# EAGLE design OneWireGateway_2x_0.2 (EAGLE 7.2.0)
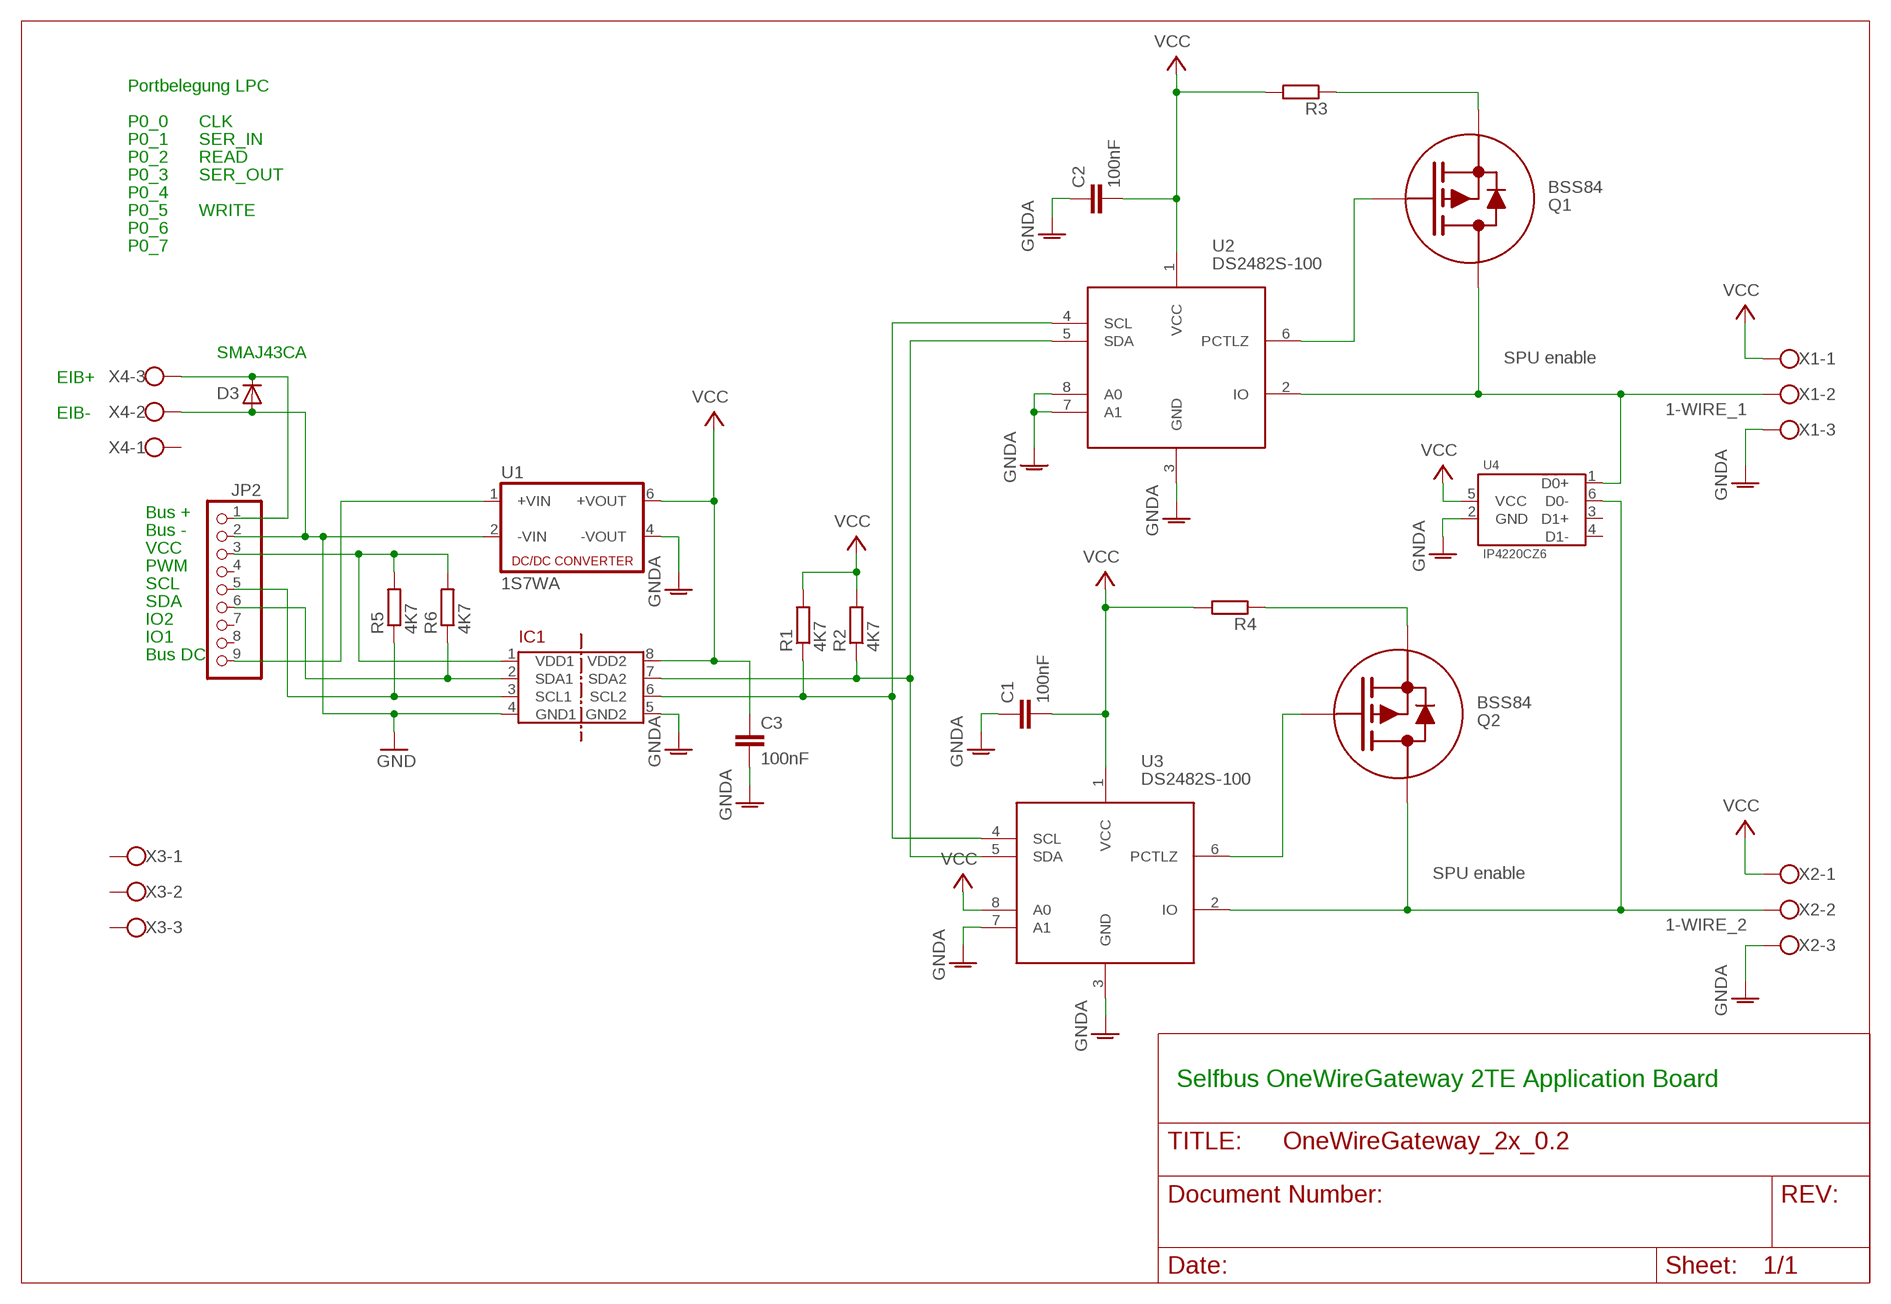
[diagram p0: schematic, sheet 1]

## Parts
C1  100nF  C-EUC0805  [C0805]
C2  100nF  C-EUC0805  [C0805]
C3  100nF  C-EUC0805  [C0805]
D3  D-SMB  [SMB]
IC1  ADUM1250  [SO08]
JP2  PINHD-1X9  [1X09]
Q1  BSS84  BSS841  [SOT-23-3]
Q2  BSS84  BSS841  [SOT-23-3]
R1  4K7  R-EU_R0805  [R0805]
R2  4K7  R-EU_R0805  [R0805]
R3  R-EU_R0805  [R0805]
R4  R-EU_R0805  [R0805]
R5  4K7  R-EU_R0805  [R0805]
R6  4K7  R-EU_R0805  [R0805]
U1  1S7WA  [7PIN_SIP]
U2  DS2482S-100  DS2482-100+1  [SO8]
U3  DS2482S-100  DS2482-100+1  [SO8]
U4  IP4220CZ6  [SOT-6]
X1  W237-03P  [W237-133]
X2  W237-03P  [W237-133]
X3  W237-3E  [W237-3E]
X4  W237-3E  [W237-3E]

## Nets
1-WIRE_1: Q1.3(D) U2.2(IO) U4.1(D0+) X1.2
1-WIRE_2: Q2.3(D) U3.2(IO) U4.6(D0-) X2.2
EIB+: D3.1(C) JP2.1 X4.3
GND: D3.2(A) IC1.4(GND1) JP2.2 U1.2(-VIN) X4.2
GNDA: C1.1 C2.1 C3.2 IC1.5(GND2) U1.4(-VOUT) U2.3(GND) U2.7(A1) U2.8(A0) U3.3(GND) U3.7(A1) U4.2(GND) X1.3 X2.3
N$2: Q1.1(G) U2.6(PCTLZ)
N$3: Q1.2(S) R3.1
N$4: JP2.9 U1.1(+VIN)
N$5: Q2.1(G) U3.6(PCTLZ)
N$6: IC1.2(SDA1) JP2.6 R6.1
N$7: IC1.3(SCL1) JP2.5 R5.1
N$10: Q2.2(S) R4.1
N$11: IC1.1(VDD1) JP2.3 R5.2 R6.2
SCL: IC1.6(SCL2) R1.1 U2.4(SCL) U3.4(SCL)
SDA: IC1.7(SDA2) R2.1 U2.5(SDA) U3.5(SDA)
VCC: C1.2 C2.2 C3.1 IC1.8(VDD2) R1.2 R2.2 R3.2 R4.2 U1.6(+VOUT) U2.1(VCC) U3.1(VCC) U3.8(A0) U4.5(VCC) X1.1 X2.1
Unconnected: JP2.4 JP2.7 JP2.8 U4.3(D1+) U4.4(D1-) X3.1 X3.2 X3.3 X4.1

## Notes on the sheet
- Portbelegung LPC
- P0_0 | CLK
- P0_1 | SER_IN
- P0_2 | READ
- P0_3 | SER_OUT
- P0_4
- P0_5 | WRITE
- P0_6
- P0_7
- SMAJ43CA
- SPU enable
- EIB+
- EIB-
- Bus +
- Bus -
- VCC
- PWM
- SCL
- SDA
- IO2
- IO1
- Bus DC
- SPU enable
- Selfbus OneWireGateway 2TE Application Board

## Library data of the parts
C1-C3 = rcl:C-EU: CAPACITOR, European symbol
D3 = semicon-smd-ipc:D-: DIODE unfilled
IC1 = Bus-isolators:ADUM1250
JP2 = pinhead:PINHD-1X9: PIN HEADER
Q1 Q2 = ak:BSS84: MOSFET SOT-23 P-CH ENHANCE; MF: Fairchild Semiconductor; MPN: BSS84; OC_DIGIKEY: BSS84CT-ND; OC_FARNELL: 2323155; OC_MOUSER: 512-BSS84
R1-R6 = rcl:R-EU_: RESISTOR, European symbol
U1 = dcdc_Gaptec:1S7WA
U2 U3 = ak:DS2482-100+: 1-Wire to I2C Bridge; MF: Maxim Integrated; MPN: DS2482-100+; OC_DIGIKEY: DS2482S-100+T&RCT-ND; OC_FARNELL: 1593289; OC_MOUSER: 700-DS2482S-100
U4 = NXP:IP4220CZ6
X1 X2 = con-wago-508:W237-03P: WAGO SREW CLAMP
X3 X4 = con-wago-508:W237-3E: WAGO SREW CLAMP

## Board
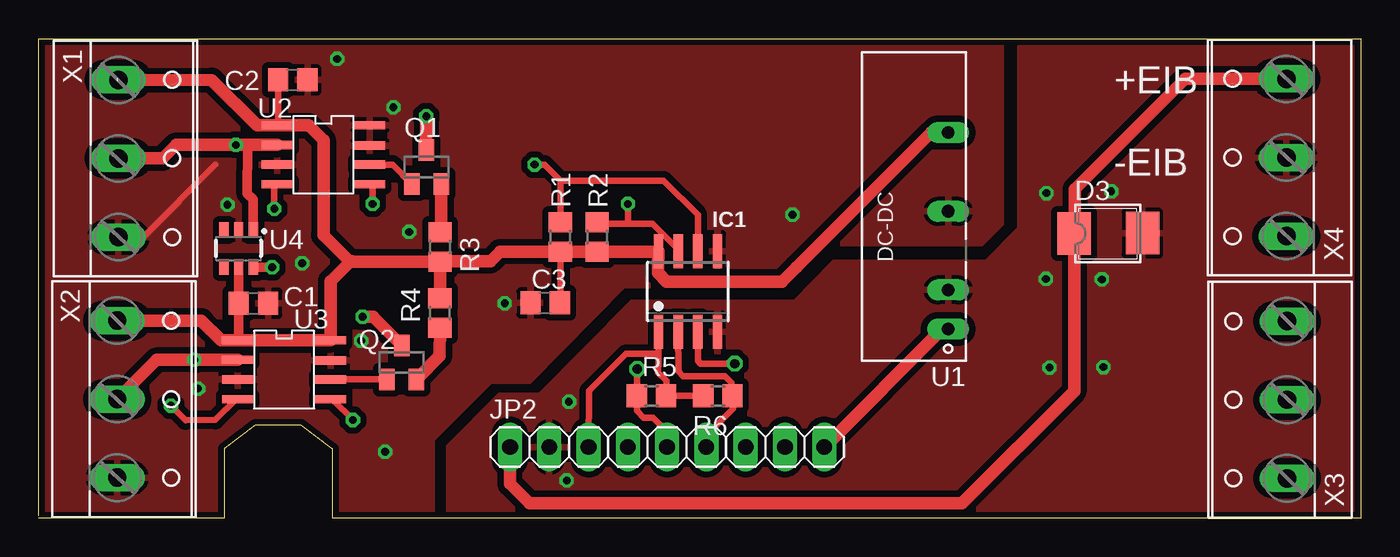
[diagram p1: board, top side]
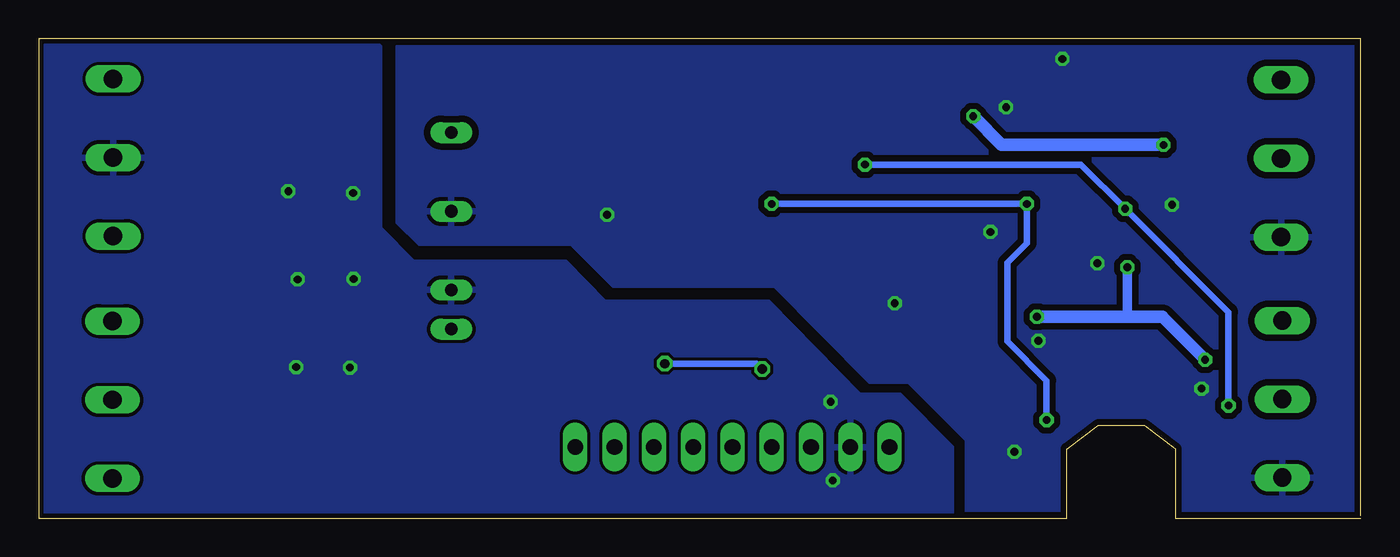
[diagram p2: board, bottom side, seen from below]

Size 85.5 x 31 mm. Coordinates in mm from the lower left corner, seen from the top.
Outline: 0.01,0.16 0.01,31 85.5,31 85.5,0 19,0 19,4.5 18.99,4.51 16.99,6.01 14.01,6.01 14.01,6 12,4.49 12,0 0,0
Copper layers (1*16): Top 0.035mm / dielectric 1.5mm / Bottom 0.035mm
Design rules "default_freebus *": minimum track width 10mil, minimum drill 24mil, track to track 8mil, track to pad 8mil, pad to pad 8mil, via to via 8mil, smd to smd 8mil, copper to edge 12mil, drill to drill 8mil, minimum pad ring 11mil, minimum via ring 8mil, stop-mask expansion 4mil, vias tented up to drill 20mil, thermal gap 10mil

### Footprints (pad centres in the part's own frame; a part is rotated, then mirrored left to right if it is on the bottom)
C0805 = smd 1.3 x 1.5: 1 -0.95,0; 2 0.95,0
SMB = smd 2.159 x 2.743: 1 -2.311,-0.127; 2 2.108,-0.102
SO08 = smd 0.6 x 2.2: 1 -1.905,-2.6; 2 -0.635,-2.6; 3 0.635,-2.6; 4 1.905,-2.6; 5 1.905,2.6; 6 0.635,2.6; 7 -0.635,2.6; 8 -1.905,2.6
1X09 = drill 1.016 long: 1 -10.16,0; 2 -7.62,0; 3 -5.08,0; 4 -2.54,0; 5 0,0; 6 2.54,0; 7 5.08,0; 8 7.62,0; 9 10.16,0
SOT-23-3 = smd 1 x 1.4: 1 -0.95,-1.1; 2 0.95,-1.1; 3 0,1.1
R0805 = smd 1.3 x 1.5: 1 -0.95,0; 2 0.95,0
7PIN_SIP = drill 0.813 long: 1 -2.54,3.81; 2 -2.54,1.27; 4 -2.54,-3.81; 6 -2.54,-8.89
SO8 = smd 2 x 0.53: 1 -3,1.905; 2 -3,0.635; 3 -3,-0.635; 4 -3,-1.905; 5 3,-1.905; 6 3,-0.635; 7 3,0.595; 8 3,1.905
SOT-6 = smd 1 x 0.6: 1 -1.2,0.95; 2 -1.2,0; 3 -1.2,-0.95; 4 1.2,-0.95; 5 1.2,0; 6 1.2,0.95
W237-133 = drill 1.194 long: 1 -5.08,-0.635; 2 0,-0.635; 3 5.08,-0.635
W237-3E = drill 1.194 long: 1 -5.08,-0.635; 2 0,-0.635; 3 5.08,-0.635

### Placement (x,y rotation side)
C1  13.89,13.89 180 top
C2  16.43,28.34 180 top
C3  32.75,13.92 180 top
D3  69.27,18.54 0 top
IC1  41.99,14.66 0 top
JP2  40.64,4.61 0 top
Q1  25.08,22.7 0 top
Q2  23.48,10.08 0 top
R1  33.73,18.18 270 top
R2  36.11,18.18 270 top
R3  25.95,17.54 270 top
R4  25.95,13.27 90 top
R5  39.63,7.91 0 top
R6  43.93,7.91 180 top
U1  56.28,16.04 180 top
U2  18.41,23.5 0 top
U3  15.87,9.61 0 top
U4  12.93,17.44 270 top
X1  5.79,23.26 270 top
X2  5.71,7.7 270 top
X3  80.1,7.66 90 top
X4  80.05,23.32 90 top

### Tracks (layer width: path | path; a pad name or v marks a point on that pad's centre or on a via)
1-WIRE_1  (via drill 0.5)
  Top 0.406: v12.76,24.13 12.52,24.13 | 13.51,24.04 13.42,24.13
  Top 0.61: U4.1 13.87,20.62 13.5,20.99 13.51,24.04
  Top 0.813: X1.2 8.02,23.26 8.89,24.13 12.52,24.13 | v12.76,24.13 13.42,24.13 U2.2 | v25.07,25.98 25.07,23.82 Q1.3
  Bottom 0.406: v12.77,24.14 v12.76,24.13
  Bottom 0.813: v12.77,24.14 23.23,24.14 v25.07,25.98
1-WIRE_2  (via drill 0.5)
  Top 0.406: 15.08,16.24 v15.1,16.22
  Top 0.61: U4.6 15.08,16.24
  Top 0.813: U3.2 10.16,10.24 | 10.16,10.24 7.62,10.24 X2.2 | v10.07,10.25 10.16,10.24 | v20.95,13.02 21.63,13.02 Q2.3
  Bottom 0.406: 15.1,13.05 15.13,13.02
  Bottom 0.61: v15.1,16.22 15.1,13.05
  Bottom 0.813: v20.95,13.02 15.13,13.02 12.83,13.02 v10.07,10.25
EIB+
  Top 0.813: JP2.1 30.48,2.22 31.75,0.95 59.69,0.95 66.96,8.23 D3.1 67.02,19.61 67.02,21.27 74.15,28.4 X4.3
GND  (via drill 0.5)
  other vias: 69.36,21.13 65.16,21.02 65.14,15.47 68.75,15.44 68.85,9.77 65.37,9.74 34.29,7.53 34.15,2.44
  pour Top (isolate 0.406): 29.84,7.94 26.54,4.61 26.55,0.02 85.09,0 85.09,30.48 63.5,30.48 63.5,18.73 61.28,16.51 51.43,16.51 48.92,13.93 38.36,13.93 32.42,7.93
  pour Bottom: 26.52,0.02 85.09,0 85.09,30.48 63.5,30.48 63.5,18.73 61.28,16.51 51.43,16.51 48.91,13.93 38.3,13.92 32.43,7.93 29.84,7.94 26.52,4.6
GNDA  (via drill 0.5)
  Top 0.406: X1.3 6.75,18.18 11.43,22.86
  other vias: 22.94,26.56 23.95,18.51 17.04,16.48 20.86,11.48 22.4,4.3 19.3,29.69 48.75,19.62 10.3,8.38 30.14,13.9 12.21,20.26
  pour Top (isolate 0.406): 25.4,0 25.4,5.08 29.21,8.89 31.75,8.89 37.83,15.05 48.3,15.05 50.8,17.78 60.96,17.78 62.23,19.05 62.23,30.48 0,30.48 0,0
  pour Bottom (isolate 0.406): 0,0 25.4,0 25.4,5.08 29.21,8.89 31.75,8.89 37.9,15.08 48.28,15.06 51.05,17.8 60.85,17.79 62.23,19.13 62.23,30.48 0,30.48
N$2
  Top 0.406: U2.6 22.87,22.86 Q1.1
N$3
  Top 0.406: 26.03,18.57 R3.1
  Top 0.813: Q1.2 26.03,18.57
N$4
  Top 0.813: U1.1 58.42,12.23 JP2.9
N$5
  Top 0.406: U3.6 20.65,8.97 Q2.1
N$6
  Top 0.406: IC1.2 41.36,9.5 41.68,9.18 44.39,9.17 44.81,8.75 44.82,7.68 R6.1 44.89,7.08 43.18,5.37 JP2.6
N$7  (via drill 0.6)
  Top 0.406: IC1.3 42.62,10.18 42.81,9.99 v45.02,9.99 | v38.71,9.64 R5.1 38.68,6.96 39.13,6.51 39.73,6.51 40.63,5.61 40.63,4.62 JP2.5
  Bottom 0.406: v45.02,9.99 39.07,9.99 v38.71,9.64
N$10
  Top 0.813: R4.1 25.94,10.5 Q2.2
N$11
  Top 0.406: IC1.1 40.08,10.08 40.08,10.63 | JP2.3 35.58,8.23 37.98,10.63 40.08,10.63 | 40.08,10.63 40.07,10.06 40.06,9.48 40.06,9.42 40.59,8.89 R5.2 R6.2
SCL  (via drill 0.5)
  Top 0.406: U3.4 12.78,7.7 11.43,6.35 9.51,6.33 v8.55,7.28 | v15.24,20 15.24,21.42 U2.4 | IC1.6 42.62,19.61 40.41,21.82 33.75,21.82 33.74,21.83 | 33.65,19.21 R1.1 33.74,21.83 | v32.07,22.86 32.71,22.86 33.74,21.83
  Bottom 0.406: v8.55,7.28 8.55,13.32 v15.24,20 18.1,22.86 v32.07,22.86
SDA  (via drill 0.5)
  Top 0.406: U3.5 18.97,7.7 v20.32,6.35 | v21.59,20.32 21.59,21.42 U2.5 | IC1.7 41.35,17.38 39.69,19.05 38.1,19.05 | 38.1,19.05 36.19,19.05 R2.1 | v38.1,20.32 38.1,19.05
  Bottom 0.406: v20.32,6.35 20.32,8.89 22.86,11.43 22.86,16.51 21.59,17.78 v21.59,20.32 v38.1,20.32
VCC
  Top 0.406: C2.2 15.48,25.47 U2.1 | 20.15,16.58 20.26,16.62 | 12.94,11.58 U3.1 12.33,11.51 | C1.2 | R1.2 33.73,13.96 C3.1
  Top 0.61: C1.2 12.94,11.58 | U4.5 C1.2
  Top 0.813: X1.1 11.2,28.33 14.14,25.39 U2.1 17.46,25.4 18.41,24.45 18.41,18.31 20.15,16.58 18.87,15.33 U3.8 12.33,11.51 11.79,11.51 10.52,12.78 X2.1 | U1.6 58.65,24.93 57.73,24.95 49.01,16.24 49,16.24 48.07,15.3 40.61,15.3 40.05,15.86 40.05,17.23 IC1.8 | R3.2 25.98,16.62 29.22,16.62 29.83,17.23 R1.2 R2.2 40.05,17.23 IC1.8 | R3.2 20.4,16.59 20.26,16.62 | R3.2 R4.2 | 40.1,16.82 IC1.8

### Text on the board
tPlace: +EIB | -EIB